# EAGLE schematic room_interface (EAGLE 6.4)
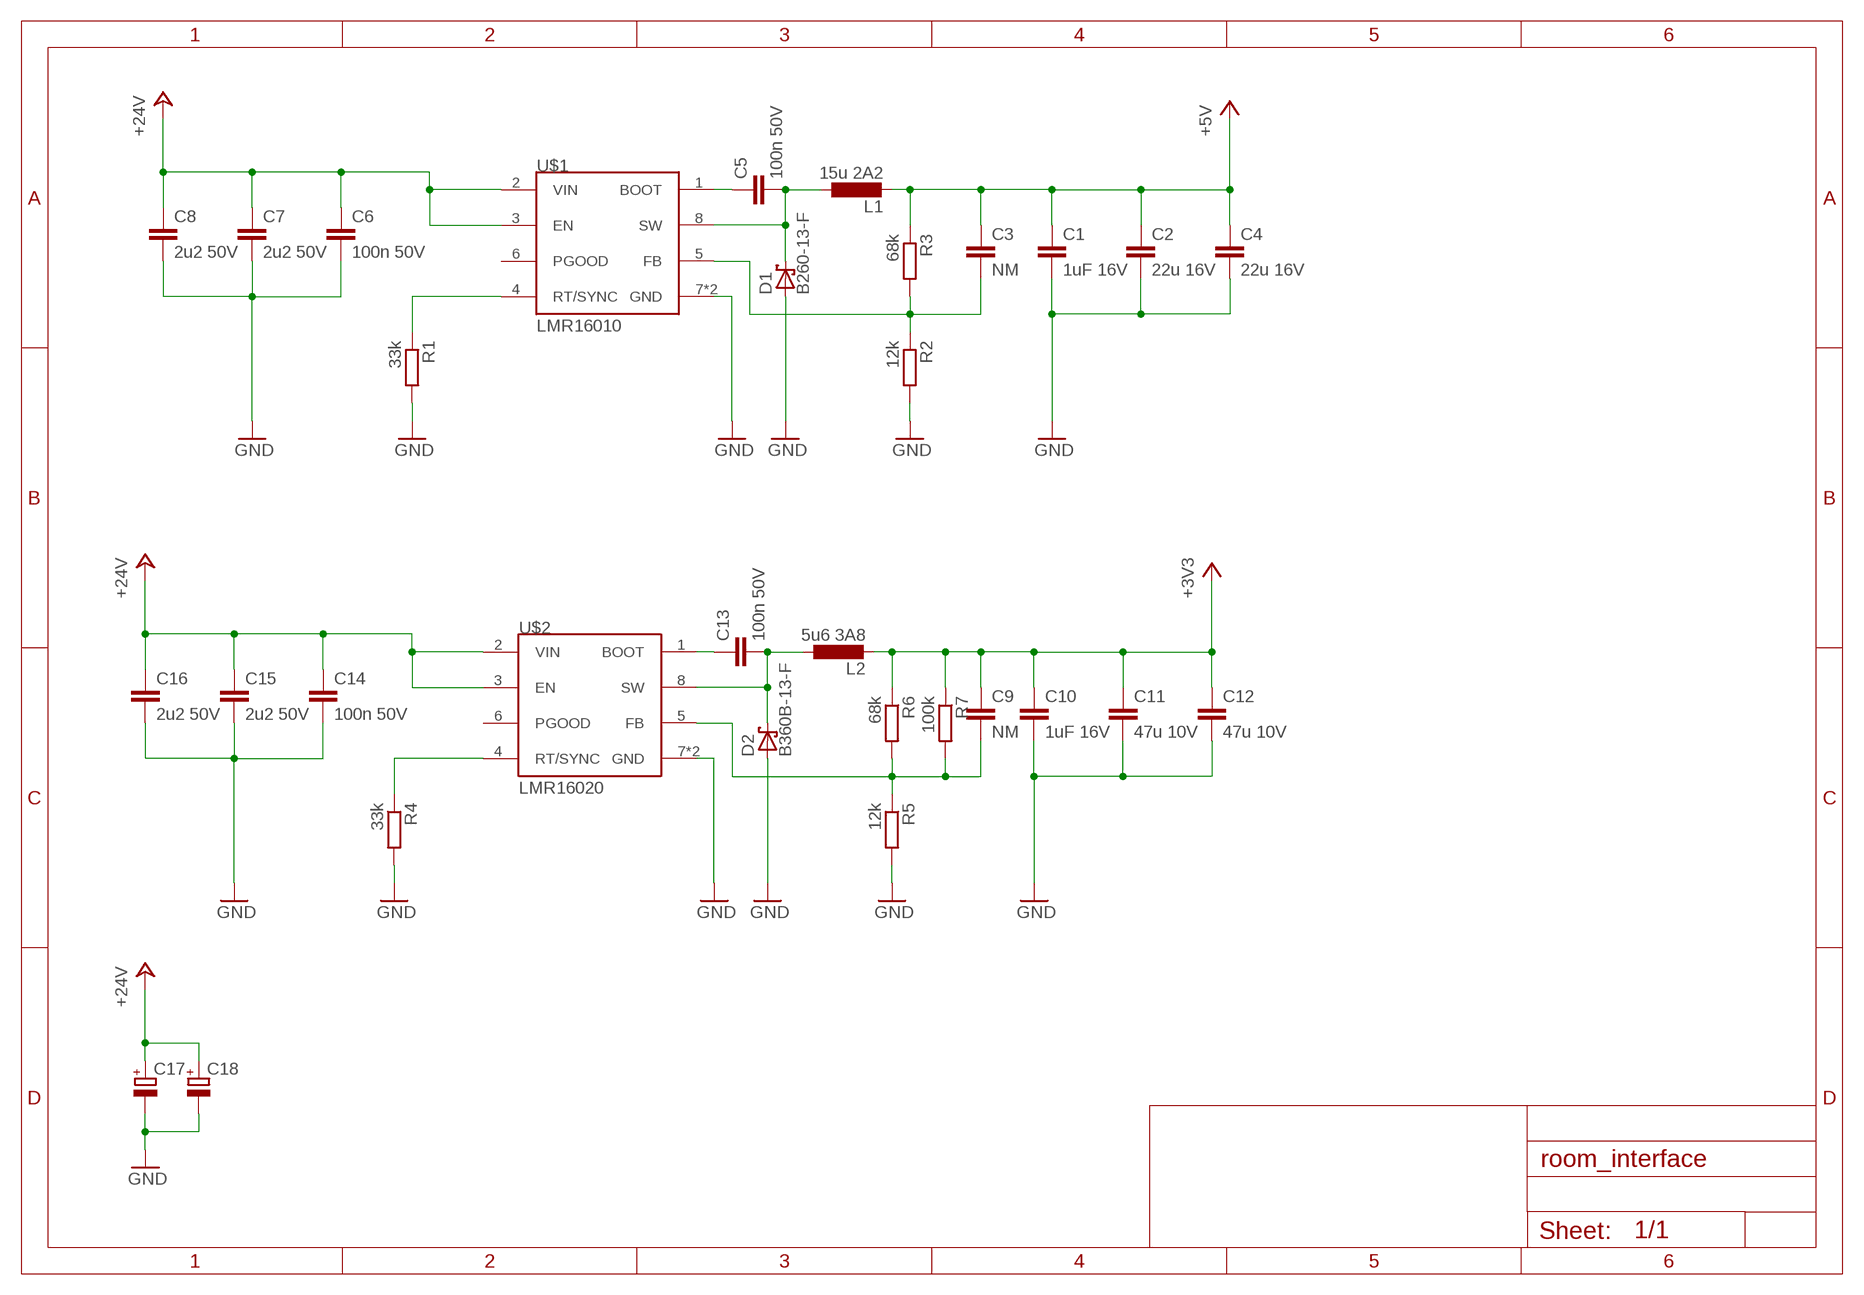
[diagram p0: schematic, sheet 1]

## Parts
C1  1uF 16V  C-EUC0805  [C0805]
C2  22u 16V  C-EUC1210  [C1210]
C3  NM  C-EUC1206  [C1206]
C4  22u 16V  C-EUC1210  [C1210]
C5  100n 50V  C-EUC1206  [C1206]
C6  100n 50V  C-EUC1206  [C1206]
C7  2u2 50V  C-EUC1206  [C1206]
C8  2u2 50V  C-EUC1206  [C1206]
C9  NM  C-EUC1206  [C1206]
C10  1uF 16V  C-EUC0805  [C0805]
C11  47u 10V  C-EUC1210  [C1210]
C12  47u 10V  C-EUC1210  [C1210]
C13  100n 50V  C-EUC1206  [C1206]
C14  100n 50V  C-EUC1206  [C1206]
C15  2u2 50V  C-EUC1206  [C1206]
C16  2u2 50V  C-EUC1206  [C1206]
C17  CPOL-EUUD-5X5,8  [UD-5X5,8_NICHICON]
C18  CPOL-EUUD-5X5,8  [UD-5X5,8_NICHICON]
D1  B260-13-F  MBRS130LT3  [SMB]
D2  B360B-13-F  MBRS130LT3  [SMB]
L1  15u 2A2  SLF10145T-150M2R2-PF  [SLF10145T-150M2R2-PF]
L2  5u6 3A8  SLF10145T-150M2R2-PF  [SLF10145T-150M2R2-PF]
R1  33k  R-EU_R1206  [R1206]
R2  12k  R-EU_R1206  [R1206]
R3  68k  R-EU_R1206  [R1206]
R4  33k  R-EU_R1206  [R1206]
R5  12k  R-EU_R1206  [R1206]
R6  68k  R-EU_R1206  [R1206]
R7  100k  R-EU_R1206  [R1206]
U$1  LMR16010  [SOIC127P600X170-8N]
U$2  LMR16020  [SOIC127P600X170-8N]

## Nets
+3V3: C9.1 C10.1 C11.1 C12.1 L2.P$2 R6.1 R7.1
+5V: C1.1 C2.1 C3.1 C4.1 L1.P$2 R3.1
+24V: C6.1 C7.1 C8.1 C14.1 C15.1 C16.1 C17.+ C18.+ U$1.2(VIN) U$1.3(EN) U$2.2(VIN) U$2.3(EN)
GND: C1.2 C2.2 C4.2 C6.2 C7.2 C8.2 C10.2 C11.2 C12.2 C14.2 C15.2 C16.2 C17.- C18.- D1.A D2.A R1.2 R2.2 R4.2 R5.2 U$1.7(GND) U$1.9(GND) U$2.7(GND) U$2.9(GND)
N$1: C5.2 D1.C L1.P$1 U$1.8(SW)
N$2: R1.1 U$1.4(RT/SYNC)
N$3: C3.2 R2.1 R3.2 U$1.5(FB)
N$4: C5.1 U$1.1(BOOT)
N$7: R4.1 U$2.4(RT/SYNC)
N$8: C9.2 R5.1 R6.2 R7.2 U$2.5(FB)
N$9: C13.2 D2.C L2.P$1 U$2.8(SW)
N$10: C13.1 U$2.1(BOOT)
Unconnected: U$1.6(PGOOD) U$2.6(PGOOD)

## Library data of the parts
C1-C16 = rcl:C-EU: CAPACITOR, European symbol
C17 C18 = rcl:CPOL-EU: POLARIZED CAPACITOR, European symbol
D1 D2 = diode:MBRS130LT3: Schottky Power Rectifier Source: http://www.onsemi.com/pub/Collateral/MBRS130LT3-D.PDF
L1 L2 = parts:SLF10145T-150M2R2-PF
R1-R7 = rcl:R-EU_: RESISTOR, European symbol
U$1 = LMR160X0_snapEDA:LMR16010
U$2 = LMR160X0_snapEDA:LMR16020